# Altium project AMS_Master.PrjPCB (part 4 of 4)

## Sheet [7] High_Voltage.SchDoc
size A4; DocumentNumber: 7; SheetNumber: 8; SheetTotal: 10
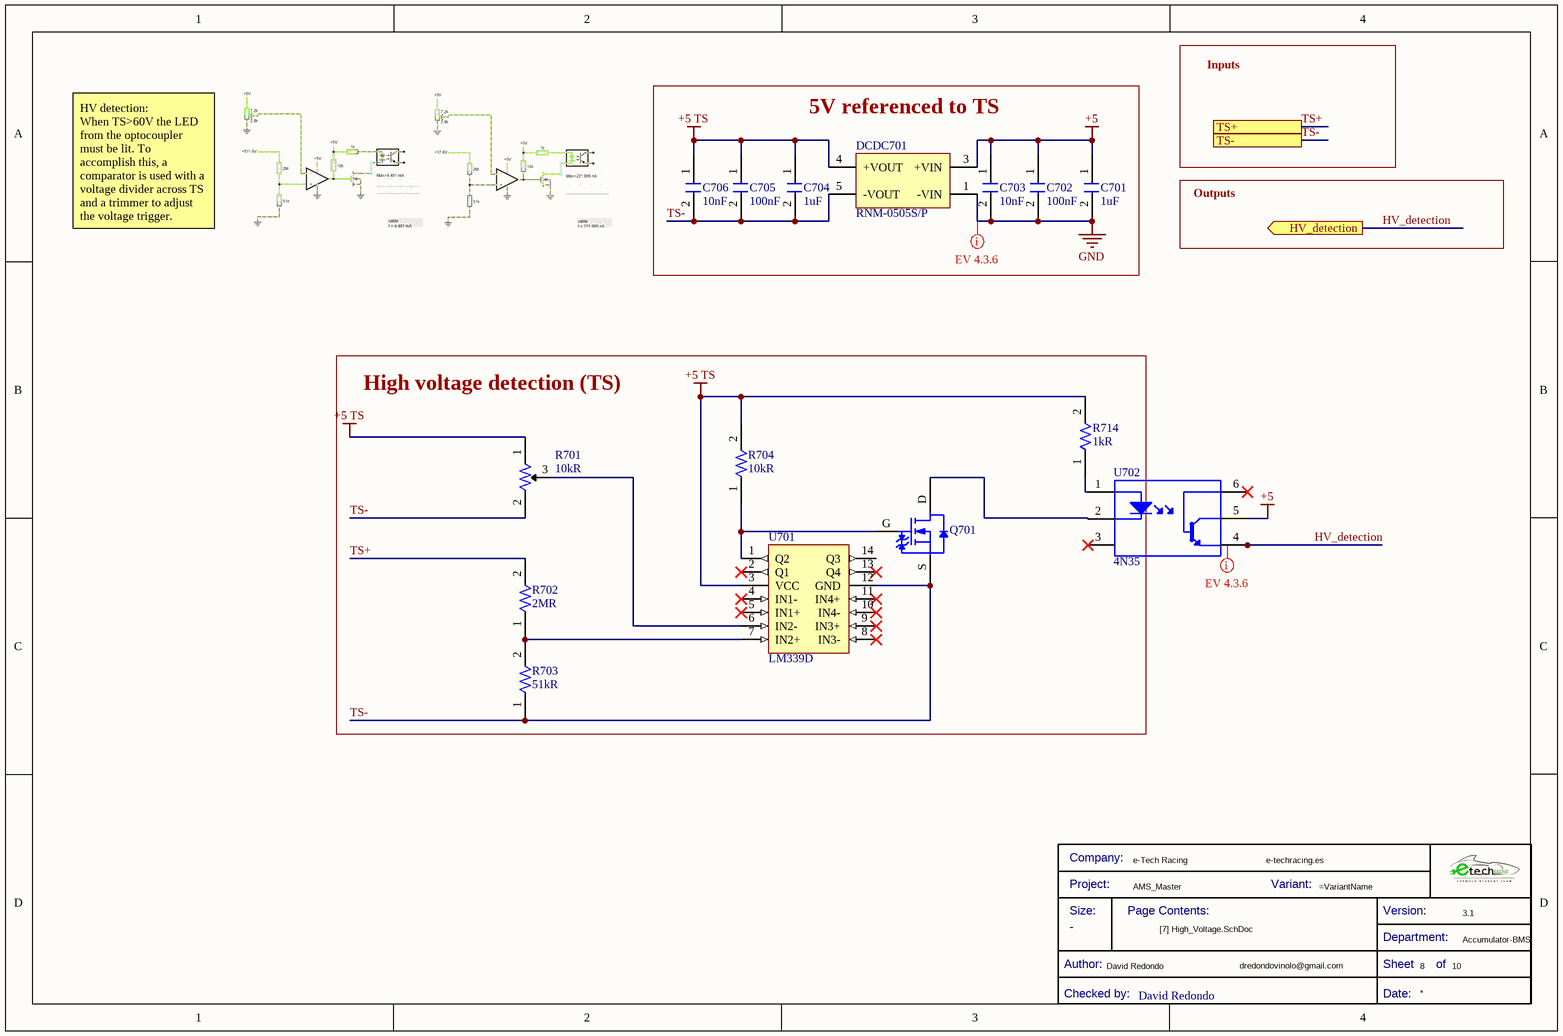
[diagram p4: [7] High_Voltage.SchDoc]

### Parts
(Parts that share a designator on the sheet are numbered #1, #2 ... from top to bottom, then left to right.)
*#4  Checked by:: David Redondo  (hidden comment: Title Block_template)  (graphical)
C701  Capacitance: 1uF  [C0805FNPC-R]  (hidden comment: 885012207103)
C702  Capacitance: 100nF  [C0805FNPC-R]  (hidden comment: 885012207098)
C703  Capacitance: 10nF  [C0805FNPC-R]  (hidden comment: 885012207092)
C704  Capacitance: 1uF  [C0805FNPC-R]  (hidden comment: 885012207103)
C705  Capacitance: 100nF  [C0805FNPC-R]  (hidden comment: 885012207098)
C706  Capacitance: 10nF  [C0805FNPC-R]  (hidden comment: 885012207092)
DCDC701  RNM-0505S/P  [DCDC_RNM-XX05S/P]
Q701  SQ2318BES-T1_GE3  [TRT-NCH-3/35-CPH]  (value not drawn)
R701  Resistance: 10kR  [R10k-VTR]  (hidden comment: 3296W-1-103LF)
R702  Resistance: 2MR  [R2512FTK]  (hidden comment: R2M-2512FTK)
R703  Resistance: 51kR  [R1206FTK-W]  (hidden comment: CRCW120610K0FKEA)
R704  Resistance: 10kR  [R0805FTK]  (hidden comment: CR0805-JW-103ELF)
R714  Resistance: 1kR  [R0805FTK]  (hidden comment: CR0805-JW-102ELF)
U701  LM339D  [Array_4_Amp_LM339D]
U702  4N35  [Optocoupler_4N35]

### Blocks framed on the sheet
5V referenced to TS: C701-C706 DCDC701
High voltage detection (TS): Q701 R701-R704 R714 U701

### Ports
HV_detection (out), TS+, TS-

### Nets
+5: C701.1 C702.1 C703.1 DCDC701.3(+VIN) U702.5(E)
+5 TS: C704.1 C705.1 C706.1 DCDC701.4(+VOUT) R701.1 R704.2 R714.2 U701.3(VCC)
GND: C701.2 C702.2 C703.2 DCDC701.1(-VIN)
HV_detection: U702.4(E) ; port HV_detection
TS+: R702.2 ; port TS+
TS-: C704.2 C705.2 C706.2 DCDC701.5(-VOUT) Q701.S R701.2 R703.1 U701.12(GND) ; port TS-
NetQ701_D: Q701.D U702.2(K)
NetQ701_G: Q701.G R704.1 U701.1(Q2)
NetR701_3: R701.3 U701.6(IN2-)
NetR702_1: R702.1 R703.2 U701.7(IN2+)
NetR714_1: R714.1 U702.1(A)

Not connected (* = marked no-connect by the designer): U701 2(Q1)* 4(IN1-)* 5(IN1+)* 8(IN3-)* 9(IN3+)* 10(IN4-)* 11(IN4+)* 13(Q4)* 14(Q3); U702 3(C)* 6(E)*

### Layout directives
mark named EV 4.3.6: (no net found under the mark), GND

### Notes on the sheet
- Inputs
- HV detection:
  When TS>60V the LED from the optocoupler must be lit. To accomplish this, a comparator is used with a voltage divider across TS and a trimmer to adjust the voltage trigger.
- Outputs
- (in symbol Title Block_template) Company:; Project:; Variant:; Size:; Page Contents:; Version:; Department:; Author:; Sheet; of; Checked by:; Date:

### Library data of the parts
*#4 = Title Block_template: Standard Title Block; Category: Title Block; Size: -
C701 C704 = C1u-50V-0805FNPC-X7R: Multilayer Ceramic Capacitor, Wcap-Csgp Series, 1 F, 10%, X7R, 50 V, 0805 [2012 Metric] Rohs Compliant: Yes; Manufacturer 1: Wurth Electronics; Voltage Rating: 50V; .Creator: GP; Supplier 1: RSComponents; Manufacturer Part Number 1: 885012207103; RoHS: Yes; Category: Ceramic Capacitors; Stock 1: 5100; Pricing 1: 50=0,27200, 250=0,25300, 500=0,22800, 1250=0,20100, 2500=0,17100 (GBP); Mount: Surface Mount; Case/Package: 0805; Case Code (Metric): 2012; Case Code (Imperial): 0805; Min Operating Temperature: -55°C; Max Operating Temperature: 85°C; Packaging: Cut Tape; Dielectric: X7R; Tolerance: 10%; Voltage Rating (DC): 50V; Length: 0.079inch; Width: 0.049inch; Thickness: 0.053inch; REACH SVHC: Unknown; RoHS Compliant: Yes; ComponentLink1URL: http://www.farnell.com/datasheets/1958501.pdf?src-supplier=Farnell; ComponentLink1Description: http://www.farnell.com/datasheets/1958501.pdf?src-supplier=Farnell; ComponentLink2URL: http://www.farnell.com/datasheets/1958501.pdf?src-supplier=Element14; ComponentLink2Description: http://www.farnell.com/datasheets/1958501.pdf?src-supplier=Element14; ComponentLink3URL: https://katalog.we-online.de/pbs/datasheet/885012107003.pdf?src-supplier=Digi-Key; ComponentLink3Description: https://katalog.we-online.de/pbs/datasheet/885012107003.pdf?src-supplier=Digi-Key; ComponentLink4URL: http://www.farnell.com/datasheets/1958501.pdf?src-supplier=Newark; ComponentLink4Description: http://www.farnell.com/datasheets/1958501.pdf?src-supplier=Newark; Supplier Part Number 1: 1813523
C702 C705 = C100n-50V-0805FNPC-X7R: Cap, 0.1ΜF, 50V, 10%, X7R, 0805; Manufacturer 1: Wurth Electronics; .Creator: DR; Supplier 1: RSComponents; Manufacturer Part Number 1: 885012207098; RoHS: Yes; Category: Ceramic Capacitors; Stock 1: 8000; Pricing 1: 100=0,10200, 500=0,07100, 2000=0,06100 (GBP); Mount: Surface Mount; Case/Package: 0805; Case Code (Metric): 2012; Case Code (Imperial): 0805; Min Operating Temperature: -55°C; Max Operating Temperature: 125°C; Packaging: Cut Tape; Voltage Rating: 50V; Dielectric: X7R; Tolerance: 10%; Voltage Rating (DC): 50V; Length: 0.079inch; Width: 0.049inch; Thickness: 0.035inch; REACH SVHC: Unknown; RoHS Compliant: Yes; ComponentLink1URL: http://www.farnell.com/datasheets/1958498.pdf?src-supplier=Farnell; ComponentLink1Description: http://www.farnell.com/datasheets/1958498.pdf?src-supplier=Farnell; ComponentLink2URL: http://www.farnell.com/datasheets/1958498.pdf?src-supplier=Element14; ComponentLink2Description: http://www.farnell.com/datasheets/1958498.pdf?src-supplier=Element14; ComponentLink3URL: https://katalog.we-online.de/pbs/datasheet/885012207098.pdf?src-supplier=Digi-Key; ComponentLink3Description: https://katalog.we-online.de/pbs/datasheet/885012207098.pdf?src-supplier=Digi-Key; ComponentLink4URL: http://www.farnell.com/datasheets/1958498.pdf?src-supplier=Newark; ComponentLink4Description: http://www.farnell.com/datasheets/1958498.pdf?src-supplier=Newark; Supplier Part Number 1: 1813493
C703 C706 = C10n-50V-0805FNPC-X7R: Cap, 0.01ΜF, 50V, 10%, X7R, 0805; Manufacturer 1: Wurth Electronics; .Creator: DR; Supplier 1: RSComponents; Manufacturer Part Number 1: 885012207092; RoHS: Yes; Category: Ceramic Capacitors; Stock 1: 1; Pricing 1: 4000=0,03200, 12000=0,03100 (USD); Mount: Surface Mount; Case/Package: 0805; Case Code (Metric): 2012; Case Code (Imperial): 0805; Min Operating Temperature: -55°C; Max Operating Temperature: 125°C; Packaging: Cut Tape; Voltage Rating: 50V; Dielectric: X7R; Tolerance: 10%; Voltage Rating (DC): 50V; Length: 0.079inch; Width: 0.049inch; Thickness: 0.035inch; REACH SVHC: Unknown; RoHS Compliant: Yes; ComponentLink1URL: http://www.farnell.com/datasheets/1958497.pdf?src-supplier=Farnell; ComponentLink1Description: http://www.farnell.com/datasheets/1958497.pdf?src-supplier=Farnell; ComponentLink2URL: http://www.farnell.com/datasheets/1958497.pdf?src-supplier=Element14; ComponentLink2Description: http://www.farnell.com/datasheets/1958497.pdf?src-supplier=Element14; ComponentLink3URL: http://www.farnell.com/datasheets/1958497.pdf?src-supplier=Newark; ComponentLink3Description: http://www.farnell.com/datasheets/1958497.pdf?src-supplier=Newark; ComponentLink4URL: https://katalog.we-online.de/pbs/datasheet/885012207092.pdf?src-supplier=Digi-Key; ComponentLink4Description: https://katalog.we-online.de/pbs/datasheet/885012207092.pdf?src-supplier=Digi-Key; Supplier Part Number 1: 1813941
DCDC701 = DCDC_RNM-0505S/P: 1W DC/DC-Converter 'ECONOLINE' DIP6 1kV unreg; V. In: 05; V. Out: 05; mA. Out: 200; Manufacturer: Recom; Min Input Voltage: 4.5V; Number of Outputs: 1; Voltage - Output 1: 5V; Max Input Voltage: 5.5V; Max Output Current: 200mA; Efficiency: 78%; Isolation: Isolated; .Creator: GP; ComponentLink1Description: Where buy it; ComponentLink1URL: https://recom-power.com/en/products/dc-dc-converters/rec-p-RNM-0505S!sP.html?0; Supplier 1: Digi-Key; RoHS: Yes; Category: Voltage Regulators - Switching; Pricing 1: 1=8,32000, 5=8,20400, 10=8,08600, 25=7,84840, 50=7,61040, 100=7,37260, 250=7,13476, 440=6,65909 (USD); Mount: Through Hole; Case/Package: DIP; Number of Pins: 4; Weight: 1.1g; Min Operating Temperature: -40°C; Max Operating Temperature: 85°C; Output Power: 1W; Packaging: Rail/Tube; Isolation Voltage: 1kV; Package Quantity: 60; Nominal Input Voltage: 5V; Max Power Dissipation: 1W; Max Output Voltage: 5V; Features: SCP; Series: ECONOLINE RNM; Output Current: 200mA; Output Voltage: 5V; Max Output Power: 1W; Current - Output 1: 200mA; Min Input Voltage (DC): 4.5V; Max Input Voltage (DC): 5.5V; Length: 8.3mm; Width: 8.3mm; Height: 6.8mm; Depth: 8.3mm; Lead Free: Lead Free; RoHS Compliant: Yes; ComponentLink2URL: https://datasheet.ciiva.com/2172/rnm-2172491.pdf?src-supplier=Digi-Key; ComponentLink2Description: https://datasheet.ciiva.com/2172/rnm-2172491.pdf?src-supplier=Digi-Key; Supplier Part Number 1: 945-2307-5-ND; Manufacturer Part Number: RNM-0505S/P
Q701 = TRT-NCH-8/40-SQ: Automotive N-channel 40 V (d-s) 175C Mosfet SOT-23; Manufacturer 1: Vishay; Id: 8A; Vds: 40V; .Creator: DO; Supplier 1: Newark; Manufacturer Part Number 1: SQ2318BES-T1_GE3; RoHS: No; Pricing 1: 1=0,71500, 5=0,71500, 10=0,64400, 25=0,59000, 50=0,52500, 100=0,47100, 250=0,40800 (USD); Supplier Part Number 1: 81AH9290; ComponentLink1Description: Where to buy; ComponentLink1URL: https://www.mouser.es/ProductDetail/Vishay-Siliconix/SQ2318BES-T1_GE3?qs=sPbYRqrBIVmyZcxPsDt0vA%3D%3D; ComponentLink2Description: Datasheet; ComponentLink2URL: https://www.mouser.es/datasheet/2/427/sq2318bes-1868475.pdf
R701 = R10k-VTR: Trimmer, Cermet, Rest 10 Kilohms, PCB, 25 Turns, Pwr-Rtg 0.5W, 3296 Series; Manufacturer: Bourns; Tolerance: 10%; Power Rating: 500mW; Number of Turns: 25; Temperature Coefficient: 100ppm/°C; Insulation Resistance: 1GR; .Creator: DO; Supplier 1: RSComponents; Manufacturer Part Number: 3296W-1-103LF; RoHS: Yes; Category: Variable Resistors and Potentiometers; Stock 1: 3300; Pricing 1: 50=2,54800, 100=2,31900, 200=2,14000, 300=1,88400, 500=1,55300 (USD); Mount: PCB,Through Hole; Weight: 0.03oz; Color: Blue; Contact Plating: Tin,Matte; Min Operating Temperature: -55°C; Max Operating Temperature: 125°C; Packaging: Rail/Tube; Package Quantity: 50; Termination: Pin; Resistor Type: Cermet; Technology: CERMET; Taper: Linear; Max Power Dissipation: 500mW; Series: 3296; Resistance Tolerance: 10%; Length: 9.53mm; Width: 9.53mm; Height: 0.395inch; Depth: 4.83mm; Radiation Hardening: No; REACH SVHC: No SVHC; Military Standard: Not; Lead Free: Lead Free; RoHS Compliant: Yes; ComponentLink1URL: https://datasheet.ciiva.com/19454/853572-19454866.pdf?src-supplier=Jameco; ComponentLink1Description: https://datasheet.ciiva.com/19454/853572-19454866.pdf?src-supplier=Jameco; ComponentLink2URL: https://datasheet.ciiva.com/11830/0900766b8069ccf4-11830871.pdf?src-supplier=RSComponents; ComponentLink2Description: https://datasheet.ciiva.com/11830/0900766b8069ccf4-11830871.pdf?src-supplier=RSComponents; ComponentLink3URL: https://datasheet.ciiva.com/29122/447277-da-01-en-trimmer-tht3296w-1-103lf-10k-0-5w-29122362.pdf?src-supplier=Conrad; ComponentLink3Description: https://datasheet.ciiva.com/29122/447277-da-01-en-trimmer-tht3296w-1-103lf-10k-0-5w-29122362.pdf?src-supplier=Conrad; ComponentLink4URL: https://datasheet.ciiva.com/26913/3296w-1-103lf-26913885.pdf?src-supplier=IIIC; ComponentLink4Description: https://datasheet.ciiva.com/26913/3296w-1-103lf-26913885.pdf?src-supplier=IIIC; ComponentLink5URL: https://datasheet.ciiva.com/1131/1815117-1131273.pdf?src-supplier=Element14; ComponentLink5Description: https://datasheet.ciiva.com/1131/1815117-1131273.pdf?src-supplier=Element14; ComponentLink6URL: https://datasheet.ciiva.com/18411/70153578-18411561.pdf?src-supplier=Allied+Electronics; ComponentLink6Description: https://datasheet.ciiva.com/18411/70153578-18411561.pdf?src-supplier=Allied+Electronics; ComponentLink7URL: https://datasheet.ciiva.com/3266/3296-3266187.pdf?src-supplier=Avnet; ComponentLink7Description: https://datasheet.ciiva.com/3266/3296-3266187.pdf?src-supplier=Avnet; ComponentLink8URL: https://datasheet.ciiva.com/30093/3296-30093899.pdf?src-supplier=Onlinecomponents.com; ComponentLink8Description: https://datasheet.ciiva.com/30093/3296-30093899.pdf?src-supplier=Onlinecomponents.com; ComponentLink9URL: https://datasheet.ciiva.com/2156/3296-2156893.pdf?src-supplier=Digi-Key; ComponentLink9Description: https://datasheet.ciiva.com/2156/3296-2156893.pdf?src-supplier=Digi-Key; ComponentLink10URL: https://datasheet.ciiva.com/14173/ew3296-dat-e-14173022.pdf?src-supplier=Distrelec; ComponentLink10Description: https://datasheet.ciiva.com/14173/ew3296-dat-e-14173022.pdf?src-supplier=Distrelec; Supplier Part Number 1: 1673377; ComponentLink11Description: Where buy it; ComponentLink11URL: https://es.rs-online.com/web/p/potenciometros-de-ajuste/5219647
R702 = R2M-2512FTK: Current Sense Resistors - SMD 3watts .002ohms 1%; Manufacturer: Vishay Dale; Manufacturer Part Number: WSLP25122L000FEA; Temperature Coefficient: 275ppm/°C; Power Rating: 3W; Supplier 1: Mouser; RoHS: Yes; Category: Chip SMD Resistors; Stock 1: 11994; Pricing 1: 1=1,07000, 10=1,07000, 50=1,07000, 100=1,07000, 1000=0,77100, 10000=0,75500 (USD); Mount: Surface Mount; Case/Package: 2512; Case Code (Imperial): 2512; Case Code (Metric): 6432; Weight: 0.001429oz; Size Code: 2512; Min Operating Temperature: -65°C; Max Operating Temperature: 170°C; Tolerance: 1%; Packaging: Tape and Reel; Resistor Type: Metal Strip; Package Quantity: 2000; Termination: SMD/SMT; Series: WSLP; Length: 6.4mm; Width: 3.2mm; Height: 0.635mm; RoHS Compliant: Yes; Lead Free: Lead Free; ComponentLink1URL: https://datasheet.ciiva.com/48527/wslp-48527354.pdf?src-supplier=Avnet; ComponentLink1Description: https://datasheet.ciiva.com/48527/wslp-48527354.pdf?src-supplier=Avnet; Supplier Part Number 1: 71-WSLP25122L000FEA
R703 = R51k-1206FTK: Res Thick Film 1206 51K Ohm 1% 1/4W ±100ppm/°C Molded SMD SMD Punched Carrier T/R; Manufacturer: Panasonic; Manufacturer Part Number: ERJ-S08F5102V; Power Rating: 250mW; Voltage Rating: 150V; Voltage Rating (DC): 200V; Current Rating: 2A; .Creator: DO; Category: Resistor; ComponentLink1Description: Datasheet; ComponentLink1URL: https://docs.rs-online.com/bca8/A700000006404581.pdf; ComponentLink2Description: Where buy it; ComponentLink2URL: https://es.rs-online.com/web/p/resistencias-de-montaje-en-superficie/6791765; Supplier 1: Mouser; RoHS: Yes; Stock 1: 4091; Pricing 1: 1=0,31000, 10=0,26700, 50=0,26700, 100=0,10700, 1000=0,05100, 10000=0,03400 (USD); Mount: Surface Mount; Case/Package: 1206; Case Code (Metric): 3216; Case Code (Imperial): 1206; Contact Plating: Tin; Min Operating Temperature: -55°C; Max Operating Temperature: 155°C; Packaging: Tape and Reel; Tolerance: 1%; Package Quantity: 5000; Resistor Type: Thick Film; Number of Terminations: 2; Temperature Coefficient: 100ppm/°C; Max Power Dissipation: 250mW; Features: Anti-Sulfur; Series: ERJ; Construction: Rectangular; Length: 3.2mm; Width: 0.063inch; Height: 0.028inch; Depth: 1.6mm; Military Standard: Not; Lead Free: Lead Free; RoHS Compliant: Yes; ComponentLink3URL: https://datasheet.ciiva.com/24023/aoa0000ce5-24023518.pdf?src-supplier=Mouser; ComponentLink3Description: https://datasheet.ciiva.com/24023/aoa0000ce5-24023518.pdf?src-supplier=Mouser; ComponentLink4URL: https://datasheet.ciiva.com/9189/aoa0000ce5-9189211.pdf?src-supplier=Avnet; ComponentLink4Description: https://datasheet.ciiva.com/9189/aoa0000ce5-9189211.pdf?src-supplier=Avnet; Supplier Part Number 1: 667-ERJ-S08F5102V
R704 = R10k-0805FTK: BOURNS         CR0805-JW-103ELF            Surface Mount Chip Resistor, Thick Film, CR Series, 10 kohm, 125 mW,  5%, 150 V; Temperature Coefficient: 200ppm/°C; Power Rating: 125mW; Voltage Rating: 150V; Voltage Rating (DC): 100V; .Creator: DR; Supplier 1: Arrow Electronics; Manufacturer 1: Bourns; Manufacturer Part Number 1: CR0805-JW-103ELF; RoHS: Yes; Category: Chip SMD Resistors; Stock 1: 57566; Pricing 1: 1=0,05790, 10=0,01540, 25=0,01340, 100=0,00340 (USD); Mount: Surface Mount; Case/Package: 0805; Number of Pins: 2; Contact Plating: Tin; Case Code (Metric): 2012; Case Code (Imperial): 0805; Min Operating Temperature: -55°C; Max Operating Temperature: 155°C; Tolerance: 5%; Resistor Type: Thick Film; Package Quantity: 1; Packaging: Tape and Reel; Number of Terminations: 2; Termination: SMD/SMT; Max Power Dissipation: 125mW; Features: Moisture Resistant; Series: CR0805; Construction: Rectangular; Resistance Tolerance: 5%; Technology: THICK FILM; Length: 2mm; Width: 1.25mm; Height: 0.5mm; Depth: 1.25mm; Thickness: 508um; Radiation Hardening: No; REACH SVHC: No SVHC; Military Standard: Not; RoHS Compliant: Yes; ComponentLink1URL: https://datasheet.ciiva.com/11821/0900766b80fcdb72-11821135.pdf?src-supplier=RSComponents; ComponentLink1Description: https://datasheet.ciiva.com/11821/0900766b80fcdb72-11821135.pdf?src-supplier=RSComponents; ComponentLink2URL: https://datasheet.ciiva.com/9122/chpreztr-9122374.pdf?src-supplier=Avnet; ComponentLink2Description: https://datasheet.ciiva.com/9122/chpreztr-9122374.pdf?src-supplier=Avnet; ComponentLink3URL: https://datasheet.ciiva.com/22693/1902866-22693254.pdf?src-supplier=Element14; ComponentLink3Description: https://datasheet.ciiva.com/22693/1902866-22693254.pdf?src-supplier=Element14; ComponentLink4URL: https://datasheet.ciiva.com/7986/691949-7986187.pdf?src-supplier=Element14; ComponentLink4Description: https://datasheet.ciiva.com/7986/691949-7986187.pdf?src-supplier=Element14; ComponentLink5URL: https://datasheet.ciiva.com/30065/159chpreztr-30065976.pdf?src-supplier=Onlinecomponents.com; ComponentLink5Description: https://datasheet.ciiva.com/30065/159chpreztr-30065976.pdf?src-supplier=Onlinecomponents.com; ComponentLink6URL: https://datasheet.ciiva.com/16783/70154685-16783482.pdf?src-supplier=Allied+Electronics; ComponentLink6Description: https://datasheet.ciiva.com/16783/70154685-16783482.pdf?src-supplier=Allied+Electronics; ComponentLink7URL: https://datasheet.ciiva.com/5548/chpreztr-5548491.pdf?src-supplier=Mouser; ComponentLink7Description: https://datasheet.ciiva.com/5548/chpreztr-5548491.pdf?src-supplier=Mouser; ComponentLink8URL: https://datasheet.ciiva.com/6559/chpreztr-6559900.pdf?src-supplier=Digi-Key; ComponentLink8Description: https://datasheet.ciiva.com/6559/chpreztr-6559900.pdf?src-supplier=Digi-Key; ComponentLink9URL: https://datasheet.ciiva.com/6559/chpreztr-6559901.pdf?src-supplier=Digi-Key; ComponentLink9Description: https://datasheet.ciiva.com/6559/chpreztr-6559901.pdf?src-supplier=Digi-Key; ComponentLink10URL: https://datasheet.ciiva.com/7985/1856384-7985869.pdf?src-supplier=Element14; ComponentLink10Description: https://datasheet.ciiva.com/7985/1856384-7985869.pdf?src-supplier=Element14; ComponentLink11URL: https://datasheet.ciiva.com/48692/001055517-da-01-en-smd-wid-cr0805-jw-103elf-10k-ohm-1-8w-48692118.pdf?src-supplier=Conrad; ComponentLink11Description: https://datasheet.ciiva.com/48692/001055517-da-01-en-smd-wid-cr0805-jw-103elf-10k-ohm-1-8w-48692118.pdf?src-supplier=Conrad; Supplier Part Number 1: CR0805-JW-103ELF
R714 = R1k-0805FTK: Res Thick Film 0805 1K Ohm 5% 1/8W ±200ppm/°C Molded SMD SMD Paper Tape on Plastic Reel; Manufacturer 1: Bourns; Voltage Rating (DC): 150V; Power Rating: 125mW; .Creator: GP; Supplier 1: Arrow Electronics; Manufacturer Part Number 1: CR0805-JW-102ELF; RoHS: Yes; Category: Chip SMD Resistors; Stock 1: 27510; Pricing 1: 1=0,05930, 10=0,03510, 25=0,01790, 100=0,00800, 250=0,00790, 500=0,00590, 1000=0,00360, 3000=0,00350, 6000=0,00250 (USD); Mount: Surface Mount; Case/Package: 0805; Number of Pins: 2; Contact Plating: Tin; Case Code (Metric): 2012; Case Code (Imperial): 0805; Min Operating Temperature: -55°C; Max Operating Temperature: 155°C; Resistor Type: Thick Film; Tolerance: 5%; Temperature Coefficient: 200ppm/°C; Features: Moisture Resistant; Package Quantity: 1; Packaging: Tape and Reel; Voltage Rating: 150V; Number of Terminations: 2; Termination: SMD/SMT; Max Power Dissipation: 125mW; Length: 2mm; Width: 1.25mm; Height: 0.5mm; Thickness: 508um; Depth: 1.25mm; Radiation Hardening: No; Lead Free: Lead Free; REACH SVHC: No SVHC; Military Standard: Not; ComponentLink1URL: https://datasheet.ciiva.com/11821/0900766b80fcdb72-11821134.pdf?src-supplier=RSComponents; ComponentLink1Description: https://datasheet.ciiva.com/11821/0900766b80fcdb72-11821134.pdf?src-supplier=RSComponents; ComponentLink2URL: https://datasheet.ciiva.com/15225/getdatasheetpartid-78155-15225381.pdf?src-supplier=Verical; ComponentLink2Description: https://datasheet.ciiva.com/15225/getdatasheetpartid-78155-15225381.pdf?src-supplier=Verical; ComponentLink3URL: https://datasheet.ciiva.com/22693/1902866-22693253.pdf?src-supplier=Element14; ComponentLink3Description: https://datasheet.ciiva.com/22693/1902866-22693253.pdf?src-supplier=Element14; ComponentLink4URL: https://datasheet.ciiva.com/7986/1856384-7986184.pdf?src-supplier=Element14; ComponentLink4Description: https://datasheet.ciiva.com/7986/1856384-7986184.pdf?src-supplier=Element14; ComponentLink5URL: https://datasheet.ciiva.com/7985/1856384-7985867.pdf?src-supplier=Element14; ComponentLink5Description: https://datasheet.ciiva.com/7985/1856384-7985867.pdf?src-supplier=Element14; ComponentLink6URL: https://datasheet.ciiva.com/30242/159chpreztr-30242765.pdf?src-supplier=Onlinecomponents.com; ComponentLink6Description: https://datasheet.ciiva.com/30242/159chpreztr-30242765.pdf?src-supplier=Onlinecomponents.com; ComponentLink7URL: https://datasheet.ciiva.com/6547/chpreztr-6547359.pdf?src-supplier=Digi-Key; ComponentLink7Description: https://datasheet.ciiva.com/6547/chpreztr-6547359.pdf?src-supplier=Digi-Key; Supplier Part Number 1: CR0805-JW-102ELF
U701 = Array_4_Amp_LM339D: Comparator Quad ±18V/36V 14-Pin SOIC Tube; Manufacturer: Texas Instruments; Number of Channels: 4; Nominal Supply Current: 2mA; Output Current: 20mA; Quiescent Current: 2.5mA; Max Supply Voltage: 30V; Min Supply Voltage: 2V; Min Dual Supply Voltage: 1V; Max Dual Supply Voltage: 15V; Voltage Gain: 106.02dB; Max Supply Current: 500uA; Input Bias Current: 250nA; Output Current per Channel: 6mA; Input Offset Voltage (Vos): 5mV; Response Time: 0.3us; Output Type: TTL; Dual Supply Voltage: 9V; .Creator: DO; Supplier 1: Digi-Key; RoHS: Yes; Category: Amplifiers - Op Amps, Buffer, Instrumentation; Stock 1: 10834; Pricing 1: 1=0,93000, 10=0,83500, 25=0,79240, 100=0,65090, 250=0,60848, 500=0,53774, 1000=0,46725 (USD); Mount: Surface Mount; Case/Package: SOIC; Number of Pins: 14; Contact Plating: Gold; Weight: 0.004318oz; Min Operating Temperature: 0°C; Max Operating Temperature: 70°C; Packaging: Rail/Tube; Package Quantity: 50; Number of Elements: 4; Supply Current: 2mA; Technology: BIPOLAR; Max Input Current: 250nA; Series: LM339; Length: 8.65mm; Width: 3.91mm; Height: 1.58mm; Radiation Hardening: No; REACH SVHC: No SVHC; Lead Free: Lead Free; RoHS Compliant: Yes; ComponentLink1URL: https://datasheet.ciiva.com/15131/getdatasheetpartid-248452-15131099.pdf?src-supplier=Verical; ComponentLink1Description: https://datasheet.ciiva.com/15131/getdatasheetpartid-248452-15131099.pdf?src-supplier=Verical; ComponentLink2URL: https://datasheet.ciiva.com/1483/1831045-1483000.pdf?src-supplier=Element14; ComponentLink2Description: https://datasheet.ciiva.com/1483/1831045-1483000.pdf?src-supplier=Element14; ComponentLink3URL: https://datasheet.ciiva.com/1827/lm139a-1827534.pdf?src-supplier=Digi-Key; ComponentLink3Description: https://datasheet.ciiva.com/1827/lm139a-1827534.pdf?src-supplier=Digi-Key; ComponentLink4URL: https://datasheet.ciiva.com/2970/lm2901-2970484.pdf?src-supplier=Avnet; ComponentLink4Description: https://datasheet.ciiva.com/2970/lm2901-2970484.pdf?src-supplier=Avnet; ComponentLink5URL: https://datasheet.ciiva.com/48712/001010753-da-01-en-ic-quad-diff-comp-lm339d-soic-14-tid-48712470.pdf?src-supplier=Conrad; ComponentLink5Description: https://datasheet.ciiva.com/48712/001010753-da-01-en-ic-quad-diff-comp-lm339d-soic-14-tid-48712470.pdf?src-supplier=Conrad; Supplier Part Number 1: 296-1013-5-ND; ComponentLink6Description: Where buy it; ComponentLink6URL: https://es.rs-online.com/web/p/comparadores/0858411; Manufacturer Part Number: LM339D
U702 = Optocoupler_4N35: Optocoupler DC-IN 1-CH Transistor With Base DC-OUT 6-Pin PDIP SMD T/R; Manufacturer: Vishay Lite-On; Manufacturer Part Number: CNY17-4S-TA1; Number of Channels: 1; Max Power Dissipation: 250mW; Isolation Voltage: 5kV; Output Voltage: 70V; Forward Voltage: 1.65V; Rise Time: 10000ns; Collector Emitter Saturation Voltage: 300mV; Max Input Current: 60mA; Reverse Breakdown Voltage: 6V; Input Type: DC; Current Transfer Ratio: 320%; Output Current per Channel: 150mA; .Creator: DO; Supplier 1: RSComponents; RoHS: Yes; Category: Optocouplers; Stock 1: 1; Pricing 1: 50=0,27200, 250=0,25600, 500=0,24000, 1250=0,22500, 2500=0,21200 (USD); Mount: Surface Mount; Case/Package: SMD/SMT; Number of Pins: 6; Min Operating Temperature: -55°C; Max Operating Temperature: 100°C; Packaging: Tape and Reel; Package Quantity: 1000; Power Dissipation: 250mW; Collector Emitter Voltage (VCEO): 70V; Max Output Voltage: 70V; Number of Elements: 1; Series: -; Forward Current: 60mA; Collector-emitter Voltage-Max: 300mV; Fall Time: 10000ns; Number of Circuits: 1; Max Collector Current: 150mA; Radiation Hardening: No; Lead Free: Lead Free; RoHS Compliant: Yes; ComponentLink1URL: https://datasheet.ciiva.com/15118/getdatasheetpartid-187668-15118874.pdf?src-supplier=Verical; ComponentLink1Description: https://datasheet.ciiva.com/15118/getdatasheetpartid-187668-15118874.pdf?src-supplier=Verical; ComponentLink2URL: https://datasheet.ciiva.com/6573/s-110-cny17-6573733.pdf?src-supplier=Digi-Key; ComponentLink2Description: https://datasheet.ciiva.com/6573/s-110-cny17-6573733.pdf?src-supplier=Digi-Key; Supplier Part Number 1: 1278380P; ComponentLink3Description: Where buy it; ComponentLink3URL: https://es.rs-online.com/web/p/circuitos-integrados-optoacopladores/1257571

## Sheet [6] Precharge.SchDoc
size A4; DocumentNumber: 6; SheetNumber: 7; SheetTotal: 10
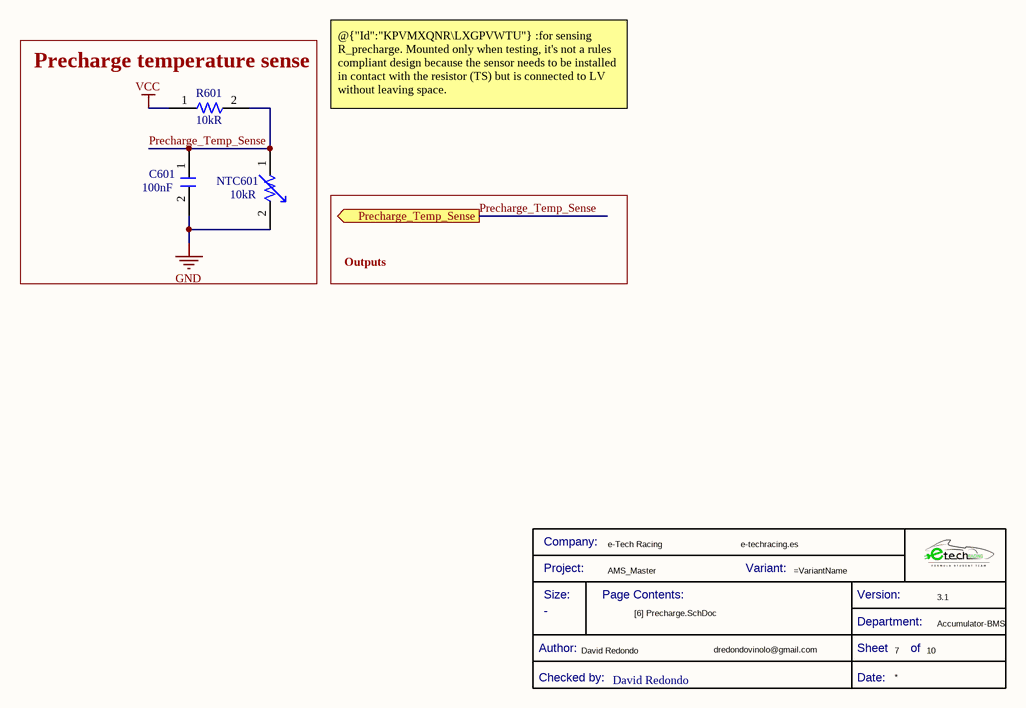
[diagram p5: [6] Precharge.SchDoc]

### Parts
(Parts that share a designator on the sheet are numbered #1, #2 ... from top to bottom, then left to right.)
*?#2  Checked by:: David Redondo  (hidden comment: Title Block_template)  (graphical)
C601  Capacitance: 100nF  [C0805FNPC-R]  (hidden comment: 885012207098)
NTC601  Resistance: 10kR  [NTC_NXRT15XV103FA1B040]  (hidden comment: NXRT15XV103FA1B040)
R601  Resistance: 10kR  [R0805FTK]  (hidden comment: CR0805-JW-103ELF)

### Blocks framed on the sheet
Precharge temperature sense: C601 NTC601 R601

### Ports
Precharge_Temp_Sense (out)

### Nets
GND: C601.2 NTC601.2
VCC: R601.1
Precharge_Temp_Sense: C601.1 NTC601.1 R601.2 ; port Precharge_Temp_Sense

### Notes on the sheet
- @{"Id":"KPVMXQNR\LXGPVWTU"} :for sensing R_precharge. Mounted only when testing, it's not a rules compliant design because the sensor needs to be installed in contact with the resistor (TS) but is connected to LV without leaving space.
- Outputs
- (in symbol Title Block_template) Company:; Project:; Variant:; Size:; Page Contents:; Version:; Department:; Author:; Sheet; of; Checked by:; Date:

### Library data of the parts
*?#2 = Title Block_template: Standard Title Block; Category: Title Block; Size: -
C601 = C100n-50V-0805FNPC-X7R: as C702 on sheet [7] High_Voltage; Supplier 1: RSComponents; Manufacturer Part Number 1: 885012207098; RoHS: Yes; Category: Ceramic Capacitors; Stock 1: 8000; Pricing 1: 100=0,10200, 500=0,07100, 2000=0,06100 (GBP); Mount: Surface Mount; Case/Package: 0805; Case Code (Metric): 2012; Case Code (Imperial): 0805; Min Operating Temperature: -55°C; Max Operating Temperature: 125°C; Packaging: Cut Tape; Voltage Rating: 50V; Dielectric: X7R; Tolerance: 10%; Voltage Rating (DC): 50V; Length: 0.079inch; Width: 0.049inch; Thickness: 0.035inch; REACH SVHC: Unknown; RoHS Compliant: Yes; ComponentLink1URL: http://www.farnell.com/datasheets/1958498.pdf?src-supplier=Farnell; ComponentLink1Description: http://www.farnell.com/datasheets/1958498.pdf?src-supplier=Farnell; ComponentLink2URL: http://www.farnell.com/datasheets/1958498.pdf?src-supplier=Element14; ComponentLink2Description: http://www.farnell.com/datasheets/1958498.pdf?src-supplier=Element14; ComponentLink3URL: https://katalog.we-online.de/pbs/datasheet/885012207098.pdf?src-supplier=Digi-Key; ComponentLink3Description: https://katalog.we-online.de/pbs/datasheet/885012207098.pdf?src-supplier=Digi-Key; ComponentLink4URL: http://www.farnell.com/datasheets/1958498.pdf?src-supplier=Newark; ComponentLink4Description: http://www.farnell.com/datasheets/1958498.pdf?src-supplier=Newark; Supplier Part Number 1: 1813493
NTC601 = NTC_NXRT15XV103FA1B040: NXR Series 10 kOhm 3900 K ±1% Bead NTC Thermistor Sensor; Manufacturer 1: Murata; Power Rating: 7.5mW; Lead Diameter: 0.4mm; Supplier 1: Digi-Key; Manufacturer Part Number 1: NXRT15XV103FA1B040; RoHS: Yes; Category: Thermistors; Stock 1: 38458; Pricing 1: 1=0,63000, 5=0,60000, 10=0,52300, 25=0,45920, 50=0,38140, 100=0,32490, 500=0,28248, 1000=0,24717, 5000=0,21892 (USD); Mount: Through Hole; Number of Pins: 2; Min Operating Temperature: -40°C; Max Operating Temperature: 125°C; Packaging: Bulk; Termination: Radial; Tolerance: 1%; Package Quantity: 500; Series: NXR; Resistance Tolerance: 1%; Max Power Dissipation: 7.5mW; Length: 5mm; Width: 4mm; Height: 2mm; Lead Pitch: 2.5mm; Lead Free: Lead Free; RoHS Compliant: No; ComponentLink1URL: http://www.mouser.com/ds/2/281/r44e-3685.pdf?src-supplier=Mouser; ComponentLink1Description: http://www.mouser.com/ds/2/281/r44e-3685.pdf?src-supplier=Mouser; ComponentLink2URL: https://www.murata.com/en-us/products/productdata/8796838297630/S0423E.pdf?src-supplier=Digi-Key; ComponentLink2Description: https://www.murata.com/en-us/products/productdata/8796838297630/S0423E.pdf?src-supplier=Digi-Key; ComponentLink3URL: http://www.murata.com/~/media/webrenewal/support/library/catalog/products/thermistor/ntc/r44e.ashx?src-supplier=Avnet; ComponentLink3Description: http://www.murata.com/~/media/webrenewal/support/library/catalog/products/thermistor/ntc/r44e.ashx?src-supplier=Avnet; Supplier Part Number 1: 490-7171-ND
R601 = R10k-0805FTK: as R704 on sheet [7] High_Voltage; Supplier 1: Arrow Electronics; Manufacturer 1: Bourns; Manufacturer Part Number 1: CR0805-JW-103ELF; RoHS: Yes; Category: Chip SMD Resistors; Stock 1: 57566; Pricing 1: 1=0,05790, 10=0,01540, 25=0,01340, 100=0,00340 (USD); Mount: Surface Mount; Case/Package: 0805; Number of Pins: 2; Contact Plating: Tin; Case Code (Metric): 2012; Case Code (Imperial): 0805; Min Operating Temperature: -55°C; Max Operating Temperature: 155°C; Tolerance: 5%; Resistor Type: Thick Film; Package Quantity: 1; Packaging: Tape and Reel; Number of Terminations: 2; Termination: SMD/SMT; Max Power Dissipation: 125mW; Features: Moisture Resistant; Series: CR0805; Construction: Rectangular; Resistance Tolerance: 5%; Technology: THICK FILM; Length: 2mm; Width: 1.25mm; Height: 0.5mm; Depth: 1.25mm; Thickness: 508um; Radiation Hardening: No; REACH SVHC: No SVHC; Military Standard: Not; RoHS Compliant: Yes; ComponentLink1URL: https://datasheet.ciiva.com/11821/0900766b80fcdb72-11821135.pdf?src-supplier=RSComponents; ComponentLink1Description: https://datasheet.ciiva.com/11821/0900766b80fcdb72-11821135.pdf?src-supplier=RSComponents; ComponentLink2URL: https://datasheet.ciiva.com/9122/chpreztr-9122374.pdf?src-supplier=Avnet; ComponentLink2Description: https://datasheet.ciiva.com/9122/chpreztr-9122374.pdf?src-supplier=Avnet; ComponentLink3URL: https://datasheet.ciiva.com/22693/1902866-22693254.pdf?src-supplier=Element14; ComponentLink3Description: https://datasheet.ciiva.com/22693/1902866-22693254.pdf?src-supplier=Element14; ComponentLink4URL: https://datasheet.ciiva.com/7986/691949-7986187.pdf?src-supplier=Element14; ComponentLink4Description: https://datasheet.ciiva.com/7986/691949-7986187.pdf?src-supplier=Element14; ComponentLink5URL: https://datasheet.ciiva.com/30065/159chpreztr-30065976.pdf?src-supplier=Onlinecomponents.com; ComponentLink5Description: https://datasheet.ciiva.com/30065/159chpreztr-30065976.pdf?src-supplier=Onlinecomponents.com; ComponentLink6URL: https://datasheet.ciiva.com/16783/70154685-16783482.pdf?src-supplier=Allied+Electronics; ComponentLink6Description: https://datasheet.ciiva.com/16783/70154685-16783482.pdf?src-supplier=Allied+Electronics; ComponentLink7URL: https://datasheet.ciiva.com/5548/chpreztr-5548491.pdf?src-supplier=Mouser; ComponentLink7Description: https://datasheet.ciiva.com/5548/chpreztr-5548491.pdf?src-supplier=Mouser; ComponentLink8URL: https://datasheet.ciiva.com/6559/chpreztr-6559900.pdf?src-supplier=Digi-Key; ComponentLink8Description: https://datasheet.ciiva.com/6559/chpreztr-6559900.pdf?src-supplier=Digi-Key; ComponentLink9URL: https://datasheet.ciiva.com/6559/chpreztr-6559901.pdf?src-supplier=Digi-Key; ComponentLink9Description: https://datasheet.ciiva.com/6559/chpreztr-6559901.pdf?src-supplier=Digi-Key; ComponentLink10URL: https://datasheet.ciiva.com/7985/1856384-7985869.pdf?src-supplier=Element14; ComponentLink10Description: https://datasheet.ciiva.com/7985/1856384-7985869.pdf?src-supplier=Element14; ComponentLink11URL: https://datasheet.ciiva.com/48692/001055517-da-01-en-smd-wid-cr0805-jw-103elf-10k-ohm-1-8w-48692118.pdf?src-supplier=Conrad; ComponentLink11Description: https://datasheet.ciiva.com/48692/001055517-da-01-en-smd-wid-cr0805-jw-103elf-10k-ohm-1-8w-48692118.pdf?src-supplier=Conrad; Supplier Part Number 1: CR0805-JW-103ELF

## Sheet [8] TSAL.SchDoc
size A4; DocumentNumber: 8; SheetNumber: 9; SheetTotal: 10
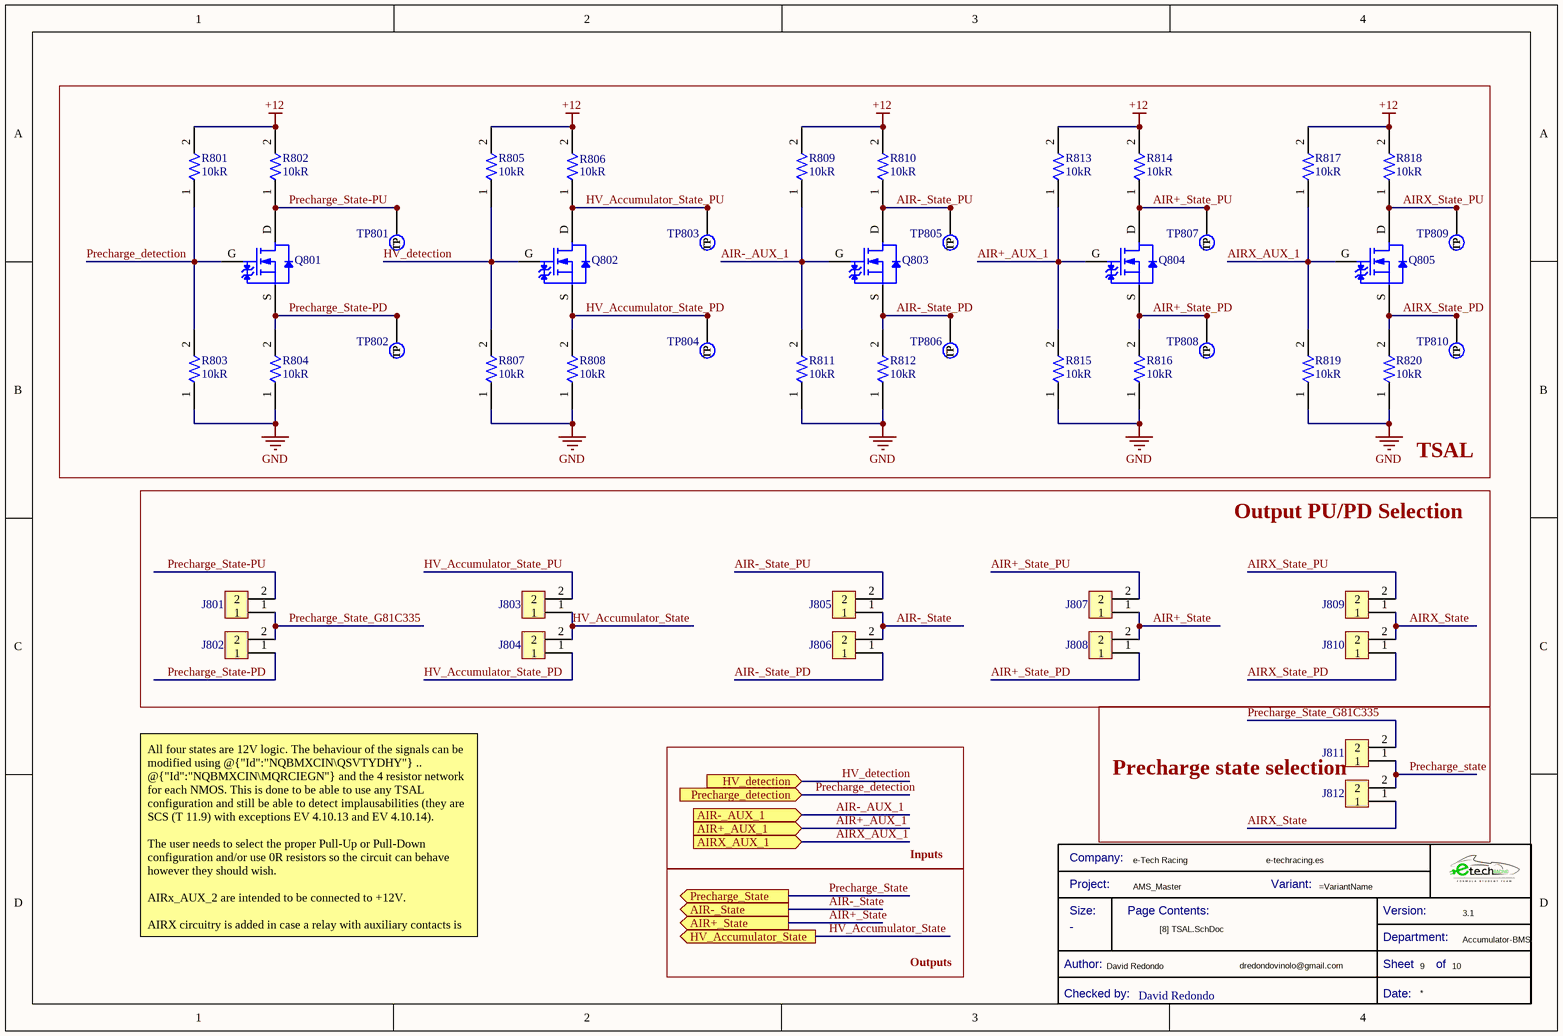
[diagram p6: [8] TSAL.SchDoc]

### Parts
(Parts that share a designator on the sheet are numbered #1, #2 ... from top to bottom, then left to right.)
*?#3  Checked by:: David Redondo  (hidden comment: Title Block_template)  (graphical)
J801  61300211121  [J_Pinheader_1x2]  (value not drawn)
J802  61300211121  [J_Pinheader_1x2]  (value not drawn)
J803  61300211121  [J_Pinheader_1x2]  (value not drawn)
J804  61300211121  [J_Pinheader_1x2]  (value not drawn)
J805  61300211121  [J_Pinheader_1x2]  (value not drawn)
J806  61300211121  [J_Pinheader_1x2]  (value not drawn)
J807  61300211121  [J_Pinheader_1x2]  (value not drawn)
J808  61300211121  [J_Pinheader_1x2]  (value not drawn)
J809  61300211121  [J_Pinheader_1x2]  (value not drawn)
J810  61300211121  [J_Pinheader_1x2]  (value not drawn)
J811  61300211121  [J_Pinheader_1x2]  (value not drawn)
J812  61300211121  [J_Pinheader_1x2]  (value not drawn)
Q801  CPH3455-TL-H  [TRT-NCH-3/35-CPH]  (value not drawn)
Q802  CPH3455-TL-H  [TRT-NCH-3/35-CPH]  (value not drawn)
Q803  CPH3455-TL-H  [TRT-NCH-3/35-CPH]  (value not drawn)
Q804  CPH3455-TL-H  [TRT-NCH-3/35-CPH]  (value not drawn)
Q805  CPH3455-TL-H  [TRT-NCH-3/35-CPH]  (value not drawn)
R801  Resistance: 10kR  [R0805FTK]  (hidden comment: CR0805-JW-103ELF)
R802  Resistance: 10kR  [R0805FTK]  (hidden comment: CR0805-JW-103ELF)
R803  Resistance: 10kR  [R0805FTK]  (hidden comment: CR0805-JW-103ELF)
R804  Resistance: 10kR  [R0805FTK]  (hidden comment: CR0805-JW-103ELF)
R805  Resistance: 10kR  [R0805FTK]  (hidden comment: CR0805-JW-103ELF)
R806  Resistance: 10kR  [R0805FTK]  (hidden comment: CR0805-JW-103ELF)
R807  Resistance: 10kR  [R0805FTK]  (hidden comment: CR0805-JW-103ELF)
R808  Resistance: 10kR  [R0805FTK]  (hidden comment: CR0805-JW-103ELF)
R809  Resistance: 10kR  [R0805FTK]  (hidden comment: CR0805-JW-103ELF)
R810  Resistance: 10kR  [R0805FTK]  (hidden comment: CR0805-JW-103ELF)
R811  Resistance: 10kR  [R0805FTK]  (hidden comment: CR0805-JW-103ELF)
R812  Resistance: 10kR  [R0805FTK]  (hidden comment: CR0805-JW-103ELF)
R813  Resistance: 10kR  [R0805FTK]  (hidden comment: CR0805-JW-103ELF)
R814  Resistance: 10kR  [R0805FTK]  (hidden comment: CR0805-JW-103ELF)
R815  Resistance: 10kR  [R0805FTK]  (hidden comment: CR0805-JW-103ELF)
R816  Resistance: 10kR  [R0805FTK]  (hidden comment: CR0805-JW-103ELF)
R817  Resistance: 10kR  [R0805FTK]  (hidden comment: CR0805-JW-103ELF)
R818  Resistance: 10kR  [R0805FTK]  (hidden comment: CR0805-JW-103ELF)
R819  Resistance: 10kR  [R0805FTK]  (hidden comment: CR0805-JW-103ELF)
R820  Resistance: 10kR  [R0805FTK]  (hidden comment: CR0805-JW-103ELF)
TP801  TestPoint  [TestPoint]  (value not drawn)  (no BOM)
TP802  TestPoint  [TestPoint]  (value not drawn)  (no BOM)
TP803  TestPoint  [TestPoint]  (value not drawn)  (no BOM)
TP804  TestPoint  [TestPoint]  (value not drawn)  (no BOM)
TP805  TestPoint  [TestPoint]  (value not drawn)  (no BOM)
TP806  TestPoint  [TestPoint]  (value not drawn)  (no BOM)
TP807  TestPoint  [TestPoint]  (value not drawn)  (no BOM)
TP808  TestPoint  [TestPoint]  (value not drawn)  (no BOM)
TP809  TestPoint  [TestPoint]  (value not drawn)  (no BOM)
TP810  TestPoint  [TestPoint]  (value not drawn)  (no BOM)

### Blocks framed on the sheet
TSAL: Q801-Q805 R801-R820 TP801-TP810
Output PU/PD Selection: J801-J810
Precharge state selection: J811 J812

### Ports
AIR+_AUX_1 (in), AIR+_State (out), AIR-_AUX_1 (in), AIR-_State (out), AIRX_AUX_1 (in), HV_Accumulator_State (out), HV_detection (in), Precharge_detection (in), Precharge_State (out)

### Nets
+12: R801.2 R802.2 R805.2 R806.2 R809.2 R810.2 R813.2 R814.2 R817.2 R818.2
GND: R803.1 R804.1 R807.1 R808.1 R811.1 R812.1 R815.1 R816.1 R819.1 R820.1
AIR+_AUX_1: Q804.G R813.1 R815.2 ; port AIR+_AUX_1
AIR+_State: J807.1 J808.2 ; port AIR+_State
AIR+_State_PD: J808.1 Q804.S R816.2 TP808.1(TP)
AIR+_State_PU: J807.2 Q804.D R814.1 TP807.1(TP)
AIR-_AUX_1: Q803.G R809.1 R811.2 ; port AIR-_AUX_1
AIR-_State: J805.1 J806.2 ; port AIR-_State
AIR-_State_PD: J806.1 Q803.S R812.2 TP806.1(TP)
AIR-_State_PU: J805.2 Q803.D R810.1 TP805.1(TP)
AIRX_AUX_1: Q805.G R817.1 R819.2 ; port AIRX_AUX_1
AIRX_State: J809.1 J810.2 J812.1
AIRX_State_PD: J810.1 Q805.S R820.2 TP810.1(TP)
AIRX_State_PU: J809.2 Q805.D R818.1 TP809.1(TP)
HV_Accumulator_State: J803.1 J804.2 ; port HV_Accumulator_State
HV_Accumulator_State_PD: J804.1 Q802.S R808.2 TP804.1(TP)
HV_Accumulator_State_PU: J803.2 Q802.D R806.1 TP803.1(TP)
HV_detection: Q802.G R805.1 R807.2 ; port HV_detection
Precharge_detection: Q801.G R801.1 R803.2 ; port Precharge_detection
Precharge_State: J811.1 J812.2 ; port Precharge_State
Precharge_State-PD: J802.1 Q801.S R804.2 TP802.1(TP)
Precharge_State-PU: J801.2 Q801.D R802.1 TP801.1(TP)
Precharge_State_G81C335: J801.1 J802.2 J811.2

### Notes on the sheet
- Inputs
- All four states are 12V logic. The behaviour of the signals can be modified using @{"Id":"NQBMXCIN\QSVTYDHY"} .. @{"Id":"NQBMXCIN\MQRCIEGN"} and the 4 resistor network for each NMOS. This is done to be able to use any TSAL configuration and still be able to detect implausabilities (they are SCS (T 11.9) with exceptions EV 4.10.13 and EV 4.10.14).
  The user needs to select the proper Pull-Up or Pull-Down configuration and/or use 0R resistors so the circuit can behave however they should wish.
  AIRx_AUX_2 are intended to be connected to +12V.
  AIRX circuitry is added in case a relay with auxiliary contacts is added as the precharge relay.
- Outputs
- (in symbol Title Block_template) Company:; Project:; Variant:; Size:; Page Contents:; Version:; Department:; Author:; Sheet; of; Checked by:; Date:

### Library data of the parts
*?#3 = Title Block_template: Standard Title Block; Category: Title Block; Size: -
J801-J812 = J_Jumper: CONN HEADER 2 POS 2.54; Manufacturer: Molex; Temperature rating: -40° to +105°C; Category type: PCB-PCB; Product name: Pin Header; Maximum current: 3 A; Maximum voltage: 250 V AC; Connections: 1x2; Current Rating: 3A; Voltage Rating: 250V; Number of Positions: 2; Gender: Male; Connector Type: Male Pin; Pitch: 0.1inch; .Creator: GP; Category: Connector; ComponentLink1Description: Datasheet; ComponentLink1URL: https://www.we-online.com/catalog/datasheet/61300211121.pdf; ComponentLink2Description: Where buy it; ComponentLink2URL: https://www.we-online.com/catalog/en/PHD_2_54_THT_PIN_HEADER_6130XX11121?sq=61300211121&sp=https%3A%2F%2Fwww.we-online.com%2Fweb%2Fen%2Fwuerth_elektronik%2Fsearchpage.php%3Fsearch%3D61300211121#61300211121; Manufacturer part number: 61300211121; Supplier: Würth Elektronik; RoHS: *; Application: Shortcircuit; Flammability: 94V-0; Orientation: Vertical; Mount: Through hole; Supplier 1: RSComponents; Stock 1: 1855; Pricing 1: 5=0,14100, 50=0,09700, 100=0,07800, 200=0,07300, 500=0,06800 (USD); Contact Plating: Gold; Housing Material: PBT; Contact Material: Copper Alloy,Copper; Color: Black; Min Operating Temperature: -40°C; Max Operating Temperature: 125°C; Number of Rows: 1; Contact Gender: Male; Packaging: Bulk; Termination: Through Hole; Number of Contacts: 2; Contact Mating Length: 0.236inch; REACH SVHC: Unknown; Lead Free: Lead Free; ComponentLink3URL: https://datasheet.ciiva.com/13619/6130xx11121-48870-13619345.pdf?src-supplier=Mouser; ComponentLink3Description: https://datasheet.ciiva.com/13619/6130xx11121-48870-13619345.pdf?src-supplier=Mouser; Supplier Part Number 1: 8281581
Q801-Q805 = TRT-NCH-3/35-CPH: CPH3455-TL-H N-channel MOSFET Transistor; 3 A; 35 V; 3-Pin CPH; Manufacturer: ON Semiconductor; Rds On Max: 104mR; Input Capacitance: 186pF; Rise Time: 4.7ns; Drain to Source Voltage (Vdss): 35V; Continuous Drain Current (ID): 3A; Max Power Dissipation: 1W; Drain to Source Resistance: 108mR; Turn-On Delay Time: 4.2ns; Turn-Off Delay Time: 15ns; Fall Time: 5.7ns; Element Configuration: Single; Gate to Source Voltage (Vgs): 20V; .Creator: GP; Category: Transistor; ComponentLink1Description: Datasheet; ComponentLink1URL: https://docs.rs-online.com/5847/0900766b812d514d.pdf; ComponentLink2Description: Where buy it; ComponentLink2URL: https://es.rs-online.com/web/p/mosfet/8009989; Supplier 1: RSComponents; Manufacturer Part Number: CPH3455-TL-H; RoHS: Yes; Stock 1: 1; Pricing 1: 50=0,50400 (USD); Case/Package: SC; Number of Pins: 3; Min Operating Temperature: -55°C; Max Operating Temperature: 150°C; Package Quantity: 3000; Packaging: Tape and Reel; Drain to Source Breakdown Voltage: 35V; Power Dissipation: 1W; Polarity: N-CHANNEL; Series: -; Length: 2.9mm; Width: 1.6mm; Height: 0.9mm; Lead Free: Lead Free; Halogen Free: Halogen Free; RoHS Compliant: Yes; ComponentLink3URL: https://datasheet.ciiva.com/947/cph3455-d-947201.pdf?src-supplier=Digi-Key; ComponentLink3Description: https://datasheet.ciiva.com/947/cph3455-d-947201.pdf?src-supplier=Digi-Key; ComponentLink4URL: https://datasheet.ciiva.com/4444/cph3455-d-91653-4444616.pdf?src-supplier=Mouser; ComponentLink4Description: https://datasheet.ciiva.com/4444/cph3455-d-91653-4444616.pdf?src-supplier=Mouser; ComponentLink5URL: https://datasheet.ciiva.com/11164/cph3455-d-11164889.pdf?src-supplier=Avnet; ComponentLink5Description: https://datasheet.ciiva.com/11164/cph3455-d-11164889.pdf?src-supplier=Avnet; Supplier Part Number 1: 8009989
R801-R820 = R10k-0805FTK: as R704 on sheet [7] High_Voltage; Supplier 1: Arrow Electronics; Manufacturer 1: Bourns; Manufacturer Part Number 1: CR0805-JW-103ELF; RoHS: Yes; Category: Chip SMD Resistors; Stock 1: 57566; Pricing 1: 1=0,05790, 10=0,01540, 25=0,01340, 100=0,00340 (USD); Mount: Surface Mount; Case/Package: 0805; Number of Pins: 2; Contact Plating: Tin; Case Code (Metric): 2012; Case Code (Imperial): 0805; Min Operating Temperature: -55°C; Max Operating Temperature: 155°C; Tolerance: 5%; Resistor Type: Thick Film; Package Quantity: 1; Packaging: Tape and Reel; Number of Terminations: 2; Termination: SMD/SMT; Max Power Dissipation: 125mW; Features: Moisture Resistant; Series: CR0805; Construction: Rectangular; Resistance Tolerance: 5%; Technology: THICK FILM; Length: 2mm; Width: 1.25mm; Height: 0.5mm; Depth: 1.25mm; Thickness: 508um; Radiation Hardening: No; REACH SVHC: No SVHC; Military Standard: Not; RoHS Compliant: Yes; ComponentLink1URL: https://datasheet.ciiva.com/11821/0900766b80fcdb72-11821135.pdf?src-supplier=RSComponents; ComponentLink1Description: https://datasheet.ciiva.com/11821/0900766b80fcdb72-11821135.pdf?src-supplier=RSComponents; ComponentLink2URL: https://datasheet.ciiva.com/9122/chpreztr-9122374.pdf?src-supplier=Avnet; ComponentLink2Description: https://datasheet.ciiva.com/9122/chpreztr-9122374.pdf?src-supplier=Avnet; ComponentLink3URL: https://datasheet.ciiva.com/22693/1902866-22693254.pdf?src-supplier=Element14; ComponentLink3Description: https://datasheet.ciiva.com/22693/1902866-22693254.pdf?src-supplier=Element14; ComponentLink4URL: https://datasheet.ciiva.com/7986/691949-7986187.pdf?src-supplier=Element14; ComponentLink4Description: https://datasheet.ciiva.com/7986/691949-7986187.pdf?src-supplier=Element14; ComponentLink5URL: https://datasheet.ciiva.com/30065/159chpreztr-30065976.pdf?src-supplier=Onlinecomponents.com; ComponentLink5Description: https://datasheet.ciiva.com/30065/159chpreztr-30065976.pdf?src-supplier=Onlinecomponents.com; ComponentLink6URL: https://datasheet.ciiva.com/16783/70154685-16783482.pdf?src-supplier=Allied+Electronics; ComponentLink6Description: https://datasheet.ciiva.com/16783/70154685-16783482.pdf?src-supplier=Allied+Electronics; ComponentLink7URL: https://datasheet.ciiva.com/5548/chpreztr-5548491.pdf?src-supplier=Mouser; ComponentLink7Description: https://datasheet.ciiva.com/5548/chpreztr-5548491.pdf?src-supplier=Mouser; ComponentLink8URL: https://datasheet.ciiva.com/6559/chpreztr-6559900.pdf?src-supplier=Digi-Key; ComponentLink8Description: https://datasheet.ciiva.com/6559/chpreztr-6559900.pdf?src-supplier=Digi-Key; ComponentLink9URL: https://datasheet.ciiva.com/6559/chpreztr-6559901.pdf?src-supplier=Digi-Key; ComponentLink9Description: https://datasheet.ciiva.com/6559/chpreztr-6559901.pdf?src-supplier=Digi-Key; ComponentLink10URL: https://datasheet.ciiva.com/7985/1856384-7985869.pdf?src-supplier=Element14; ComponentLink10Description: https://datasheet.ciiva.com/7985/1856384-7985869.pdf?src-supplier=Element14; ComponentLink11URL: https://datasheet.ciiva.com/48692/001055517-da-01-en-smd-wid-cr0805-jw-103elf-10k-ohm-1-8w-48692118.pdf?src-supplier=Conrad; ComponentLink11Description: https://datasheet.ciiva.com/48692/001055517-da-01-en-smd-wid-cr0805-jw-103elf-10k-ohm-1-8w-48692118.pdf?src-supplier=Conrad; Supplier Part Number 1: CR0805-JW-103ELF
TP801-TP810 = TestPoint: Test Point 1x1 mm; .Creator: GP; Category: TestPoint; .PCBcheck: GP; .SCHcheck: GP

## Nets that join several sheets
+5: AMS_Master (J3.4), [3] CAN (6 pins), [4] Shutdown (C403.2 R404.2 R406.2 U402.3), [7] High_Voltage (5 pins)
+12: AMS_Master (5 pins), [4] Shutdown (7 pins), [8] TSAL (10 pins)
GND: AMS_Master (9 pins), [3] CAN (26 pins), [4] Shutdown (18 pins), [2] MCU (35 pins), [7] High_Voltage (C701.2 C702.2 C703.2 DCDC701.1), [6] Precharge (C601.2 NTC601.2), [8] TSAL (10 pins)
VCC: [3] CAN (6 pins), [4] Shutdown (R416.2 R417.2 R418.2), [2] MCU (16 pins), [6] Precharge (R601.1)
Accumulator_Interlock: AMS_Master (J1.2), [4] Shutdown (5 pins)
AIR+_AUX_1: AMS_Master (J6.3), [4] Shutdown (Q404.G TP418.1), [8] TSAL (Q804.G R813.1 R815.2)
AIR+_State: AMS_Master (J1.13), [8] TSAL (J807.1 J808.2)
AIR-_AUX_1: AMS_Master (J6.7), [8] TSAL (Q803.G R809.1 R811.2)
AIR-_State: AMS_Master (J1.14), [8] TSAL (J805.1 J806.2)
AIRX_AUX_1: AMS_Master (J7.3), [8] TSAL (Q805.G R817.1 R819.2)
AMS_CAN_H: AMS_Master (J3.3 J4.2), [3] CAN (D303.2 R301.2 U301.13)
AMS_CAN_L: AMS_Master (J3.2 J4.3), [3] CAN (D304.2 R302.1 U301.12)
AMS_CAN_RXD: [3] CAN (U301.6), [2] MCU (TP230.1 U201.37)
AMS_CAN_TXD: [3] CAN (U301.3), [2] MCU (TP232.1 U201.41)
BMS_ERROR: [4] Shutdown (Q401.G R401.1), [2] MCU (TP218.1 U201.22)
BMS_Monitoring: [4] Shutdown (R417.1 U402.1), [2] MCU (TP205.1 U201.5)
BMS_OK: AMS_Master (J1.12), [4] Shutdown (5 pins)
CAN1_H: AMS_Master (J1.8), [3] CAN (D301.2 R303.2 U302.13)
CAN1_L: AMS_Master (J1.16), [3] CAN (D302.2 R304.1 U302.12)
CAN1_RXD: [3] CAN (U302.6), [2] MCU (TP221.1 U201.25)
CAN1_TXD: [3] CAN (U302.3), [2] MCU (TP222.1 U201.26)
HV_Accumulator_State: AMS_Master (J1.4), [8] TSAL (J803.1 J804.2)
HV_detection: [7] High_Voltage (U702.4), [8] TSAL (Q802.G R805.1 R807.2)
IMD_Monitoring: [4] Shutdown (R418.1 U402.14), [2] MCU (TP204.1 U201.4)
IMD_OK: AMS_Master (J1.11), [4] Shutdown (5 pins)
IMD_OK_unlatched: AMS_Master (J2.8), [4] Shutdown (J402.1 R405.2 TP405.1)
Interlock_Monitoring: [4] Shutdown (R416.1 U402.2), [2] MCU (TP203.1 U201.3)
Inverters_Enable: AMS_Master (J1.3), [4] Shutdown (Q404.D R411.1 TP419.1)
Precharge_State: AMS_Master (J1.15), [8] TSAL (J811.1 J812.2)
Precharge_Temp_Sense: [2] MCU (TP213.1 U201.15), [6] Precharge (C601.1 NTC601.1 R601.2)
SC_End: AMS_Master (J1.10 J6.1 J6.5 J7.1), [4] Shutdown (6 pins)
TS+: AMS_Master (F_TS+.1), [7] High_Voltage (R702.2)
TS-: AMS_Master (J_TS-.1 J_TS-.2), [7] High_Voltage (8 pins)

## Assembly variants
Test_Unit: all parts fitted
ETR-08: not fitted C301 C302 C303 C304 C305 C306 C307 C314 C315 C316 C317 C318 C319 C320 C401 C402 C601 D101 D102 D103 D202 D203 D401 D402 J101 J102 J103 J104 NTC601 Q402 Q403 Q404 R101 R102 R103 R202 R203 R204 R205 R206 R207 R208 R209 R210 R211 R212 R213 R403 R404 R405 R406 R407 R408 R409 R410 R411 R413 R414 R417 R418 R601 U401 X401 X402
ETR-X: not fitted C301 C302 C303 C304 C305 C306 C307 C314 C315 C316 C317 C318 C319 C320 C601 D101 D102 D103 D202 D203 J101 J102 J103 J104 J401 J402 J403 NTC601 Q404 R101 R102 R103 R202 R203 R204 R205 R206 R207 R208 R209 R210 R211 R212 R213 R411 R601